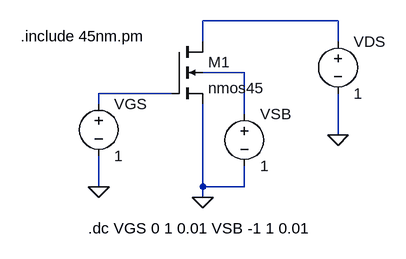
[diagram p0: schematic Nmos-45.asc]
Nmos-45.asc, the LTspice schematic file:
Version 4.1
SHEET 1 880 680
WIRE 400 48 192 48
WIRE 192 80 192 48
WIRE 400 80 400 48
WIRE 256 128 192 128
WIRE 144 160 32 160
WIRE 32 176 32 160
WIRE 256 192 256 128
WIRE 400 224 400 160
WIRE 32 304 32 256
WIRE 192 304 192 176
WIRE 256 304 256 272
WIRE 256 304 192 304
WIRE 192 320 192 304
FLAG 32 304 0
FLAG 192 320 0
FLAG 400 224 0
SYMBOL nmos4 144 80 R0
SYMATTR InstName M1
SYMATTR Value nmos45
SYMATTR Value2 l=45nm w=1u
SYMBOL voltage 32 160 R0
WINDOW 123 0 0 Left 0
WINDOW 39 0 0 Left 0
SYMATTR InstName VGS
SYMATTR Value 1
SYMBOL voltage 256 176 R0
WINDOW 123 0 0 Left 0
WINDOW 39 0 0 Left 0
SYMATTR InstName VSB
SYMATTR Value 1
SYMBOL voltage 400 64 R0
WINDOW 123 0 0 Left 0
WINDOW 39 0 0 Left 0
SYMATTR InstName VDS
SYMATTR Value 1
TEXT -88 72 Left 2 !.include 45nm.pm
TEXT 16 368 Left 2 !.dc VGS 0 1 0.01 VSB -1 1 0.01

The netlist it stands for:
* Nmos-45.asc
M1 N001 N003 0 N002 nmos45 l=45nm w=1u
VGS N003 0 1
VSB N002 0 1
VDS N001 0 1
.model NMOS NMOS
.model PMOS PMOS
.lib standard.mos
.include 45nm.pm
.dc VGS 0 1 0.01 VSB -1 1 0.01
.backanno
.end